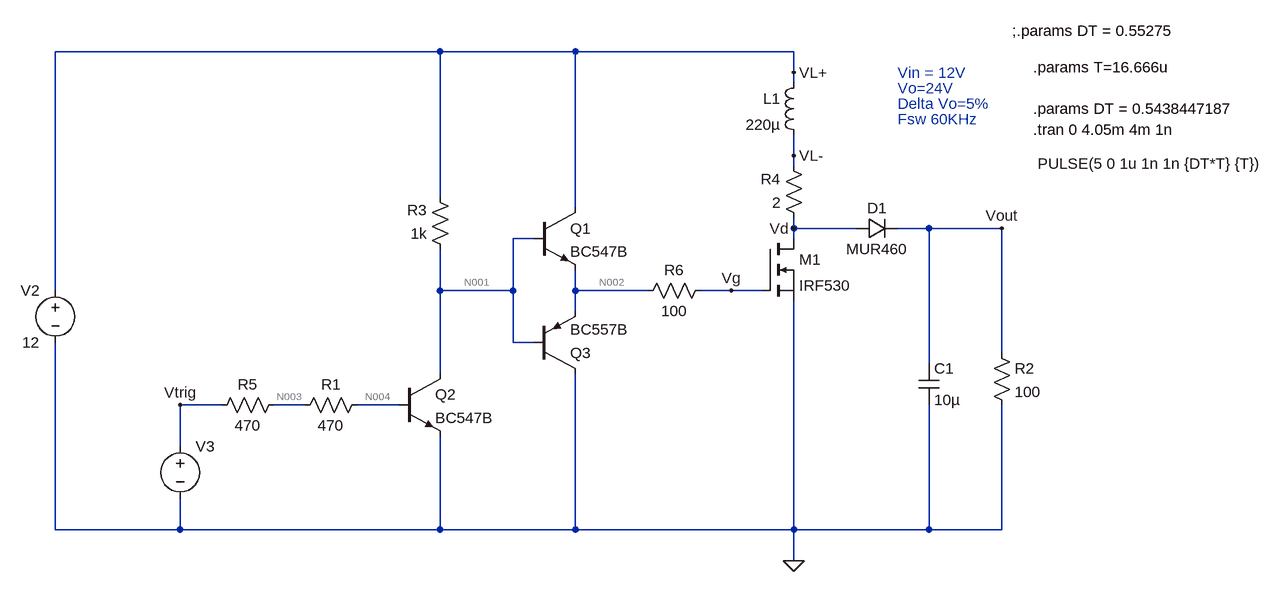
[diagram p0: schematic Draft4.asc]
Draft4.asc, the LTspice schematic file:
Version 4
SHEET 1 1320 680
WIRE 48 -272 -544 -272
WIRE 256 -272 48 -272
WIRE 592 -272 256 -272
WIRE 592 -240 592 -272
WIRE 592 -224 592 -240
WIRE 592 -112 592 -144
WIRE 592 -96 592 -112
WIRE 48 -48 48 -272
WIRE 256 -32 256 -272
WIRE 592 0 592 -16
WIRE 688 0 592 0
WIRE 800 0 752 0
WIRE 912 0 800 0
WIRE 192 16 160 16
WIRE 592 16 592 0
WIRE -544 96 -544 -272
WIRE 48 96 48 32
WIRE 160 96 160 16
WIRE 160 96 48 96
WIRE 256 96 256 64
WIRE 368 96 256 96
WIRE 496 96 448 96
WIRE 544 96 496 96
WIRE 256 128 256 96
WIRE 160 176 160 96
WIRE 192 176 160 176
WIRE 912 192 912 0
WIRE 800 208 800 0
WIRE 48 224 48 96
WIRE -288 272 -352 272
WIRE -160 272 -208 272
WIRE -16 272 -80 272
WIRE -352 336 -352 272
WIRE -544 464 -544 176
WIRE -352 464 -352 416
WIRE -352 464 -544 464
WIRE 48 464 48 320
WIRE 48 464 -352 464
WIRE 256 464 256 224
WIRE 256 464 48 464
WIRE 592 464 592 112
WIRE 592 464 256 464
WIRE 800 464 800 272
WIRE 800 464 592 464
WIRE 912 464 912 272
WIRE 912 464 800 464
WIRE 592 512 592 464
FLAG 592 512 0
FLAG 496 96 Vg
FLAG 592 -240 VL+
FLAG 592 -112 VL-
FLAG 912 0 Vout
FLAG -352 272 Vtrig
FLAG 592 0 Vd
SYMBOL npn 192 -32 R0
SYMATTR InstName Q1
SYMATTR Value BC547B
SYMBOL npn -16 224 R0
SYMATTR InstName Q2
SYMATTR Value BC547B
SYMBOL pnp 192 224 M180
SYMATTR InstName Q3
SYMATTR Value BC557B
SYMBOL nmos 544 16 R0
SYMATTR InstName M1
SYMATTR Value IRF530
SYMBOL diode 688 16 R270
WINDOW 0 32 32 VTop 2
WINDOW 3 0 32 VBottom 2
SYMATTR InstName D1
SYMATTR Value MUR460
SYMBOL res 464 80 R90
WINDOW 0 0 56 VBottom 2
WINDOW 3 32 56 VTop 2
SYMATTR InstName R6
SYMATTR Value 100
SYMBOL res -64 256 R90
WINDOW 0 0 56 VBottom 2
WINDOW 3 32 56 VTop 2
SYMATTR InstName R1
SYMATTR Value 470
SYMBOL res 608 0 R180
WINDOW 0 36 76 Left 2
WINDOW 3 36 40 Left 2
SYMATTR InstName R4
SYMATTR Value 2
SYMBOL res 64 48 R180
WINDOW 0 36 76 Left 2
WINDOW 3 36 40 Left 2
SYMATTR InstName R3
SYMATTR Value 1k
SYMBOL res -304 288 R270
WINDOW 0 32 56 VTop 2
WINDOW 3 0 56 VBottom 2
SYMATTR InstName R5
SYMATTR Value 470
SYMBOL ind 608 -240 M0
SYMATTR InstName L1
SYMATTR Value 220µ
SYMBOL voltage -544 80 M0
WINDOW 123 0 0 Left 0
WINDOW 39 0 0 Left 0
SYMATTR InstName V2
SYMATTR Value 12
SYMBOL cap 784 208 R0
SYMATTR InstName C1
SYMATTR Value 10µ
SYMBOL res 896 176 R0
SYMATTR InstName R2
SYMATTR Value 100
SYMBOL voltage -352 320 R0
WINDOW 3 1319 -420 Left 2
WINDOW 123 0 0 Left 0
WINDOW 39 0 0 Left 0
SYMATTR Value PULSE(5 0 1u 1n 1n {DT*T} {T})
SYMATTR InstName V3
TEXT 960 -152 Left 2 !.tran 0 4.05m 4m 1n
TEXT 752 -240 Left 2 ;Vin = 12V
TEXT 752 -216 Left 2 ;Vo=24V
TEXT 752 -192 Left 2 ;Delta Vo=5%
TEXT 752 -168 Left 2 ;Fsw 60KHz
TEXT 928 -304 Left 2 !;.params DT = 0.55275
TEXT 960 -248 Left 2 !.params T=16.666u
TEXT 960 -184 Left 2 !.params DT = 0.5438447187

The netlist it stands for:
* Draft4.asc
Q1 VL+ N001 N002 0 BC547B
Q2 N001 N004 0 0 BC547B
Q3 0 N001 N002 0 BC557B
M1 Vd Vg 0 0 IRF530
D1 Vd Vout MUR460
R6 Vg N002 100
R1 N004 N003 470
R4 Vd VL- 2
R3 N001 VL+ 1k
R5 Vtrig N003 470
L1 VL+ VL- 220µ
V2 VL+ 0 12
C1 Vout 0 10µ
R2 Vout 0 100
V3 Vtrig 0 PULSE(5 0 1u 1n 1n {DT*T} {T})
.model D D
.lib standard.dio
.model NPN NPN
.model PNP PNP
.lib standard.bjt
.model NMOS NMOS
.model PMOS PMOS
.lib standard.mos
.tran 0 4.05m 4m 1n
* Vin = 12V
* Vo=24V
* Delta Vo=5%
* Fsw 60KHz
;.params DT = 0.55275
.params T=16.666u
.params DT = 0.5438447187
.backanno
.end

* Results of the author's LTspice run, read from the files saved beside the schematic
* Operating Point, zero values left out:
*   V(vl+) = 12 V
*   V(n001) = 36.04 mV
*   V(n002) = 35.97 mV
*   V(n004) = 754.9 mV
*   V(vd) = 11.78 V
*   V(vg) = 35.97 mV
*   V(vout) = 11.07 V
*   V(n003) = 2.877 V
*   V(vl-) = 12 V
*   V(vtrig) = 5 V
*   Ic(Q2) = 11.96 mA
*   Ib(Q2) = 4.516 mA
*   Ie(Q2) = -16.48 mA
*   Ic(Q1) = 12.06 pA
*   Ib(Q1) = -12.03 pA
*   Id(M1) = 63.74 pA
*   Is(M1) = -63.74 pA
*   I(D1) = 110.7 mA
*   I(L1) = 110.7 mA
*   I(R2) = 110.7 mA
*   I(R5) = 4.516 mA
*   I(R3) = -11.96 mA
*   I(R4) = -110.7 mA
*   I(R1) = -4.516 mA
*   I(V3) = -4.516 mA
*   I(V2) = -122.7 mA
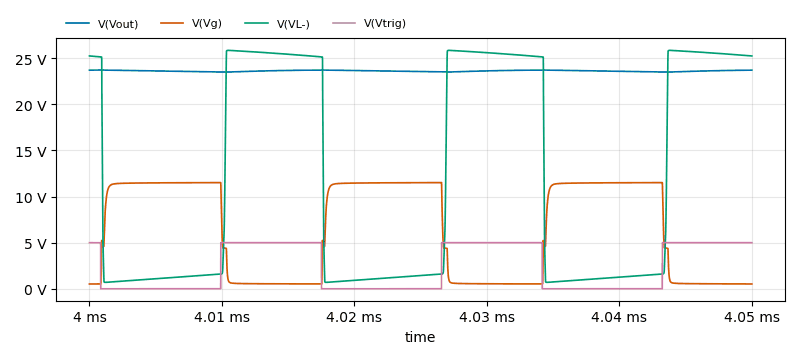
[diagram p1: Transient Analysis of Draft4.asc, plotted from the saved traces]
* Transient Analysis, 1 run:
*   V(Vout): min 23.49 V, max 23.71 V, average 23.61 V, rms 23.61 V, last 23.7 V
*   V(Vg): min 516.1 mV, max 11.51 V, average 6.46 V, rms 8.36 V, last 523 mV
*   V(VL-): min 699.5 mV, max 25.84 V, average 12 V, rms 16.98 V, last 25.24 V
*   V(Vtrig): min 0 V, max 5 V, average 2.281 V, rms 3.377 V, last 5 V